# EAGLE design home_audio_dac_v0001 (EAGLE 6.4)

## Sheet 1 of 4
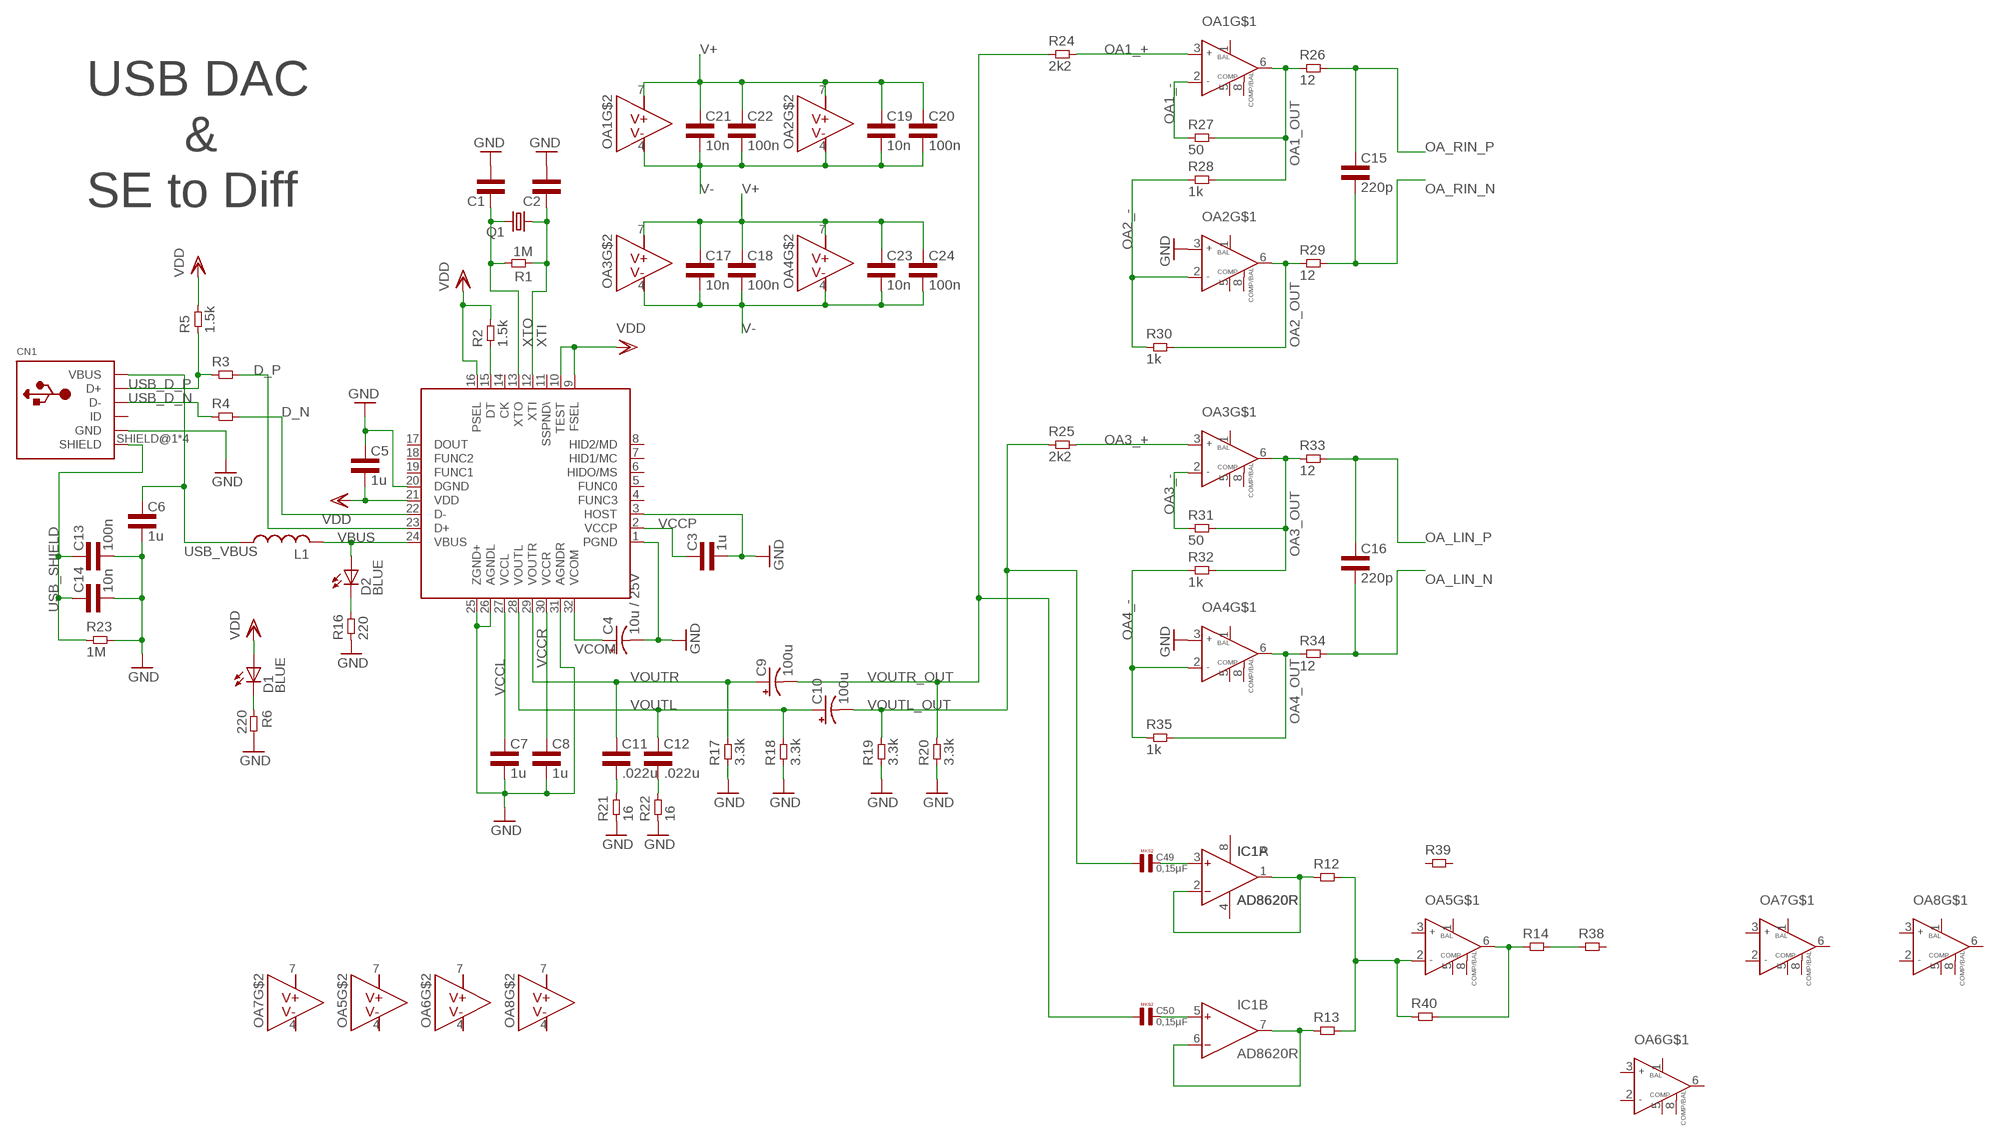
[diagram p0: schematic, sheet 1]

### Parts
C1  CAP0603L3  [0603L3]
C2  CAP0603L3  [0603L3]
C3  1u  CAP0603L3  [0603L3]
C4  10u / 25V  CPOL-USE1.8-4  [E1,8-4]
C5  1u  CAP0603L3  [0603L3]
C6  1u  CAP0603L3  [0603L3]
C7  1u  CAP0603L3  [0603L3]
C8  1u  CAP0603L3  [0603L3]
C9  100u  CPOL-USE2-5  [E2-5]
C10  100u  CPOL-USE2-5  [E2-5]
C11  .022u  CAP0603L3  [0603L3]
C12  .022u  CAP0603L3  [0603L3]
C13  100n  CAP0603L3  [0603L3]
C14  10n  CAP0603L3  [0603L3]
C15  220p  CAP0603L3  [0603L3]
C16  220p  CAP0603L3  [0603L3]
C17  10n  CAP0603L3  [0603L3]
C18  100n  CAP0603L3  [0603L3]
C19  10n  CAP0603L3  [0603L3]
C20  100n  CAP0603L3  [0603L3]
C21  10n  CAP0603L3  [0603L3]
C22  100n  CAP0603L3  [0603L3]
C23  10n  CAP0603L3  [0603L3]
C24  100n  CAP0603L3  [0603L3]
C49  0,15µF  [R5B2K5]
C50  0,15µF  [R5B2K5]
CN1  USBMINIB  [USB-MINIB]
D1  BLUE  LED-BLUE0603  [LED-0603]
D2  BLUE  LED-BLUE0603  [LED-0603]
IC1  AD8620R  [SO8]
L1  RCL_L-USL3225M  [RCL_L3225M]
OA1  NE5534ADSOIC8  [SOIC-8]
OA2  NE5534ADSOIC8  [SOIC-8]
OA3  NE5534ADSOIC8  [SOIC-8]
OA4  NE5534ADSOIC8  [SOIC-8]
OA5  NE5534SOIC8  [SOIC-8]
OA6  NE5534SOIC8  [SOIC-8]
OA7  NE5534SOIC8  [SOIC-8]
OA8  NE5534SOIC8  [SOIC-8]
Q1  PCM2707_V1_SPARKFUN_CRYSTALHC49US  [PCM2707_V1_SPARKFUN_HC49US]
R1  1M  RES0603L3  [0603L3]
R2  1.5k  RES0603L3  [0603L3]
R3  RES0603L3  [0603L3]
R4  RES0603L3  [0603L3]
R5  1.5k  RES0603L3  [0603L3]
R6  220  RES0603L3  [0603L3]
R12  RES0603L3  [0603L3]
R13  RES0603L3  [0603L3]
R14  RES0603L3  [0603L3]
R16  220  RES0603L3  [0603L3]
R17  3.3k  RES0603L3  [0603L3]
R18  3.3k  RES0603L3  [0603L3]
R19  3.3k  RES0603L3  [0603L3]
R20  3.3k  RES0603L3  [0603L3]
R21  16  RES0603L3  [0603L3]
R22  16  RES0603L3  [0603L3]
R23  1M  RES0603L3  [0603L3]
R24  2k2  RES0603L3  [0603L3]
R25  2k2  RES0603L3  [0603L3]
R26  12  RES0603L3  [0603L3]
R27  50  RES0603L3  [0603L3]
R28  1k  RES0603L3  [0603L3]
R29  12  RES0603L3  [0603L3]
R30  1k  RES0603L3  [0603L3]
R31  50  RES0603L3  [0603L3]
R32  1k  RES0603L3  [0603L3]
R33  12  RES0603L3  [0603L3]
R34  12  RES0603L3  [0603L3]
R35  1k  RES0603L3  [0603L3]
R38  RES0603L3  [0603L3]
R39  RES0603L3  [0603L3]
R40  RES0603L3  [0603L3]
U$1  PCM2707_V1_PCM2704C_PCM2707  [PCM2707_V1_PCM2704C_PCM2707]

### Nets
D_N: R4.P$2 U$1.22(D-)
D_P: R3.P$2 U$1.23(D+)
DT: R2.P$1 U$1.15(DT)
GND: C1.P$2 C2.P$2 C3.P$2 C4.- C5.P$1 C6.P$2 C7.P$2 C8.P$2 C13.P$2 C14.P$2 CN1.GND OA2.3(IN+) OA4.3(IN+) R6.P$2 R16.P$1 R17.P$1 R18.P$1 R19.P$1 R20.P$1 R21.P$1 R22.P$1 R23.P$2 U$1.1(PGND) U$1.3(HOST) U$1.20(DGND) U$1.25(ZGND+) U$1.26(AGNDL) U$1.31(AGNDR) ; also sheet 2,3,4
N$15: C49.2 IC1.3(A:IN+)
N$16: C50.2 IC1.5(B:IN+)
N$17: IC1.1(A:OUT) IC1.2(A:IN-) R12.P$1
N$18: IC1.6(B:IN-) IC1.7(B:OUT) R13.P$1
N$20: OA5.2(IN-) R12.P$2 R13.P$2 R40.P$1
N$22: OA5.6(OUT) R14.P$1 R40.P$2
N$23: R14.P$2 R38.P$1
N$56: D2.C R16.P$2
OA1_+: OA1.3(IN+) R24.P$2
OA1_-: OA1.2(IN-) R27.P$1
OA1_OUT: OA1.6(OUT) R26.P$1 R27.P$2 R28.P$2
OA2_-: OA2.2(IN-) R28.P$1 R30.P$1
OA2_OUT: OA2.6(OUT) R29.P$1 R30.P$2
OA3_+: OA3.3(IN+) R25.P$2
OA3_-: OA3.2(IN-) R31.P$1
OA3_OUT: OA3.6(OUT) R31.P$2 R32.P$2 R33.P$1
OA4_-: OA4.2(IN-) R32.P$1 R35.P$1
OA4_OUT: OA4.6(OUT) R34.P$1 R35.P$2
OA_LIN_N: C16.P$2 R34.P$2 ; also sheet 2
OA_LIN_P: C16.P$1 R33.P$2 ; also sheet 2
OA_RIN_N: C15.P$2 R29.P$2 ; also sheet 2
OA_RIN_P: C15.P$1 R26.P$2 ; also sheet 2
USB_D_N: CN1.D- R4.P$1
USB_D_P: CN1.D+ R3.P$1 R5.P$1
USB_SHIELD: C13.P$1 C14.P$1 CN1.SHIELD@1(SHIELD) CN1.SHIELD@2(SHIELD) CN1.SHIELD@3(SHIELD) CN1.SHIELD@4(SHIELD) R23.P$1
USB_VBUS: C6.P$1 CN1.VBUS L1.1
V+: C17.P$1 C18.P$1 C19.P$1 C20.P$1 C21.P$1 C22.P$1 C23.P$1 C24.P$1 OA1.7(V+) OA2.7(V+) OA3.7(V+) OA4.7(V+)
V-: C17.P$2 C18.P$2 C19.P$2 C20.P$2 C21.P$2 C22.P$2 C23.P$2 C24.P$2 OA1.4(V-) OA2.4(V-) OA3.4(V-) OA4.4(V-)
VBUS: D2.A L1.2 U$1.24(VBUS)
VCCL: C7.P$1 U$1.27(VCCL)
VCCP: C3.P$1 U$1.2(VCCP)
VCCR: C8.P$1 U$1.30(VCCR)
VCOM: C4.+ U$1.32(VCOM)
VDD: C5.P$2 D1.A R2.P$2 R5.P$2 U$1.9(FSEL) U$1.10(TEST) U$1.16(PSEL) U$1.21(VDD)
VDD_LED: D1.C R6.P$1
VOUTL: C10.+ C12.P$1 R18.P$2 U$1.28(VOUTL)
VOUTL_CAP: C12.P$2 R22.P$2
VOUTL_OUT: C10.- C49.1 R19.P$2 R25.P$1
VOUTR: C9.+ C11.P$1 R17.P$2 U$1.29(VOUTR)
VOUTR_CAP: C11.P$2 R21.P$2
VOUTR_OUT: C9.- C50.1 R20.P$2 R24.P$1
XTI: C2.P$1 Q1.1 R1.P$1 U$1.12(XTI)
XTO: C1.P$1 Q1.2 R1.P$2 U$1.13(XTO)
Unconnected: CN1.ID OA1.1(BAL) OA1.5(COMP) OA1.8(COMP/BAL) OA2.1(BAL) OA2.5(COMP) OA2.8(COMP/BAL) OA3.1(BAL) OA3.5(COMP) OA3.8(COMP/BAL) OA4.1(BAL) OA4.5(COMP) OA4.8(COMP/BAL) OA5.1(BAL) OA5.3(IN+) OA5.5(COMP) OA5.8(COMP/BAL) OA6.1(BAL) OA6.2(IN-) OA6.3(IN+) OA6.5(COMP) OA6.6(OUT) OA6.8(COMP/BAL) OA7.1(BAL) OA7.2(IN-) OA7.3(IN+) OA7.5(COMP) OA7.6(OUT) OA7.8(COMP/BAL) OA8.1(BAL) OA8.2(IN-) OA8.3(IN+) OA8.5(COMP) OA8.6(OUT) OA8.8(COMP/BAL) R38.P$2 R39.P$1 R39.P$2 U$1.4(FUNC3) U$1.5(FUNC0) U$1.6(HIDO/MS) U$1.7(HID1/MC) U$1.8(HID2/MD) U$1.11(SSPND\) U$1.14(CK) U$1.17(DOUT) U$1.18(FUNC2) U$1.19(FUNC1)

### Notes on the sheet
- USB DAC
- &
- SE to Diff

## Sheet 2 of 4
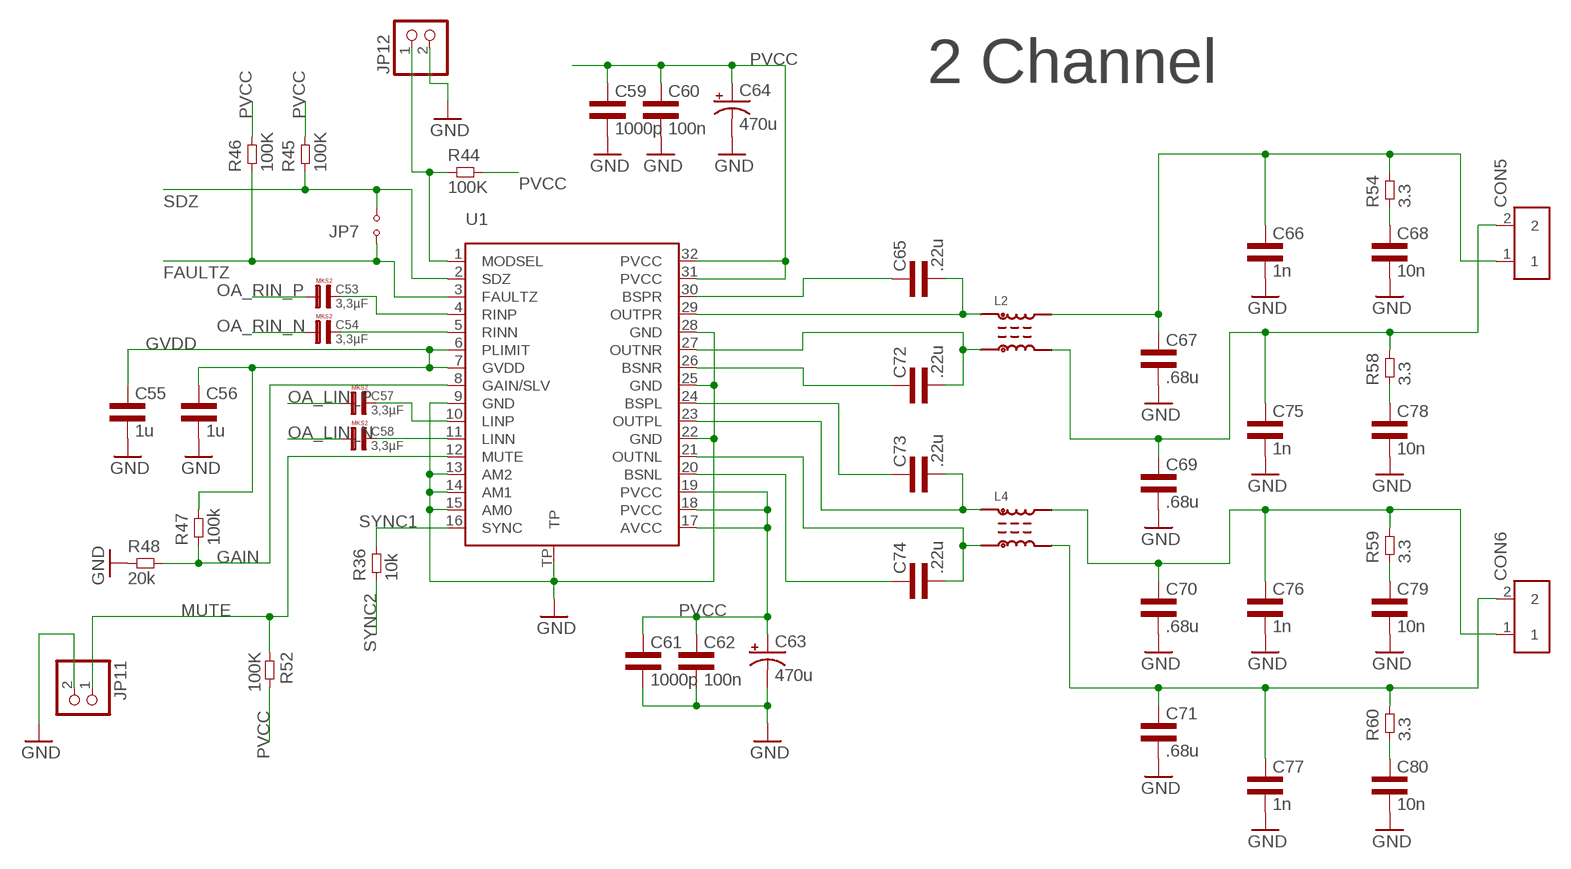
[diagram p1: schematic, sheet 2]

### Parts
C53  3,3µF  [R5B5K5]
C54  3,3µF  [R5B5K5]
C55  1u  CAP0603L3  [0603L3]
C56  1u  CAP0603L3  [0603L3]
C57  3,3µF  [R5B5K5]
C58  3,3µF  [R5B5K5]
C59  1000p  CAP0805L3  [0805L3]
C60  100n  CAP0805L3  [0805L3]
C61  1000p  CAP0805L3  [0805L3]
C62  100n  CAP0805L3  [0805L3]
C63  470u  CPOL-USF  [PANASONIC_F]
C64  470u  CPOL-USF  [PANASONIC_F]
C65  .22u  CAP0805L3  [0805L3]
C66  1n  CAP0603L3  [0603L3]
C67  .68u  CAP1206L3  [1206L3]
C68  10n  CAP0805L3  [0805L3]
C69  .68u  CAP1206L3  [1206L3]
C70  .68u  CAP1206L3  [1206L3]
C71  .68u  CAP1206L3  [1206L3]
C72  .22u  CAP0805L3  [0805L3]
C73  .22u  CAP0805L3  [0805L3]
C74  .22u  CAP0805L3  [0805L3]
C75  1n  CAP0603L3  [0603L3]
C76  1n  CAP0603L3  [0603L3]
C77  1n  CAP0603L3  [0603L3]
C78  10n  CAP0805L3  [0805L3]
C79  10n  CAP0805L3  [0805L3]
C80  10n  CAP0805L3  [0805L3]
CON5  TERM_BLOCK_2  [TERM_BLOCK_2]
CON6  TERM_BLOCK_2  [TERM_BLOCK_2]
JP7  JUMPER2  [JUMPER2]
JP11  PINHD-1X2  [1X02]
JP12  PINHD-1X2  [1X02]
L2  1155EA  [1155EA]
L4  1155EA  [1155EA]
R36  10k  RES0603L3  [0603L3]
R44  100K  RES0603L3  [0603L3]
R45  100K  RES0603L3  [0603L3]
R46  100K  RES0603L3  [0603L3]
R47  100k  RES0603L3  [0603L3]
R48  20k  RES0603L3  [0603L3]
R52  100K  RES0603L3  [0603L3]
R54  3.3  RES0805L3  [0805L3]
R58  3.3  RES0805L3  [0805L3]
R59  3.3  RES0805L3  [0805L3]
R60  3.3  RES0805L3  [0805L3]
U1  TPA3116  [R-PDSO-32]

### Nets
FAULTZ: JP7.1 R46.P$1 U1.3(FAULTZ) ; also sheet 3
GAIN: R47.P$1 R48.P$2 U1.8(GAIN/SLV) ; also sheet 3
GND: C55.P$2 C56.P$2 C59.2 C60.2 C61.2 C62.2 C63.- C64.- C66.P$2 C67.2 C68.2 C69.2 C70.2 C71.2 C75.P$2 C76.P$2 C77.P$2 C78.2 C79.2 C80.2 JP11.2 JP12.2 R48.P$1 U1.9(GND) U1.13(AM2) U1.14(AM1) U1.15(AM0) U1.22(GND) U1.25(GND) U1.28(GND) U1.TP ; also sheet 1,3,4
GVDD: C55.P$1 C56.P$1 R47.P$2 U1.6(PLIMIT) U1.7(GVDD) ; also sheet 3
LIN_CAP1_N: C58.2 U1.11(LINN)
LIN_CAP1_P: C57.2 U1.10(LINP)
MODSEL1: JP12.1 R44.P$1 U1.1(MODSEL)
MUTE: JP11.1 R52.P$1 U1.12(MUTE) ; also sheet 3
N$5: C65.1 U1.30(BSPR)
N$6: C65.2 L2.4 U1.29(OUTPR)
N$21: C66.P$1 C67.1 CON5.1 L2.3 R54.2
N$25: C68.1 R54.1
N$26: C72.1 U1.26(BSNR)
N$27: C73.1 U1.24(BSPL)
N$28: C74.1 U1.20(BSNL)
N$29: C72.2 L2.1 U1.27(OUTNR)
N$31: C73.2 L4.4 U1.23(OUTPL)
N$34: C74.2 L4.1 U1.21(OUTNL)
N$35: C69.1 C75.P$1 CON5.2 L2.2 R58.2
N$36: C70.1 C76.P$1 CON6.1 L4.3 R59.2
N$37: C71.1 C77.P$1 CON6.2 L4.2 R60.2
N$38: C78.1 R58.1
N$39: C79.1 R59.1
N$40: C80.1 R60.1
OA_LIN_N: C58.1 ; also sheet 1
OA_LIN_P: C57.1 ; also sheet 1
OA_RIN_N: C54.1 ; also sheet 1
OA_RIN_P: C53.1 ; also sheet 1
PVCC: C59.1 C60.1 C61.1 C62.1 C63.+ C64.+ R44.P$2 R45.P$2 R46.P$2 R52.P$2 U1.17(AVCC) U1.18(PVCC) U1.19(PVCC) U1.31(PVCC) U1.32(PVCC) ; also sheet 3
RIN_CAP1_N: C54.2 U1.5(RINN)
RIN_CAP1_P: C53.2 U1.4(RINP)
SDZ: JP7.2 R45.P$1 U1.2(SDZ) ; also sheet 3
SYNC1: R36.P$2 U1.16(SYNC)
SYNC2: R36.P$1 ; also sheet 3

### Notes on the sheet
- 2 Channel

## Sheet 3 of 4
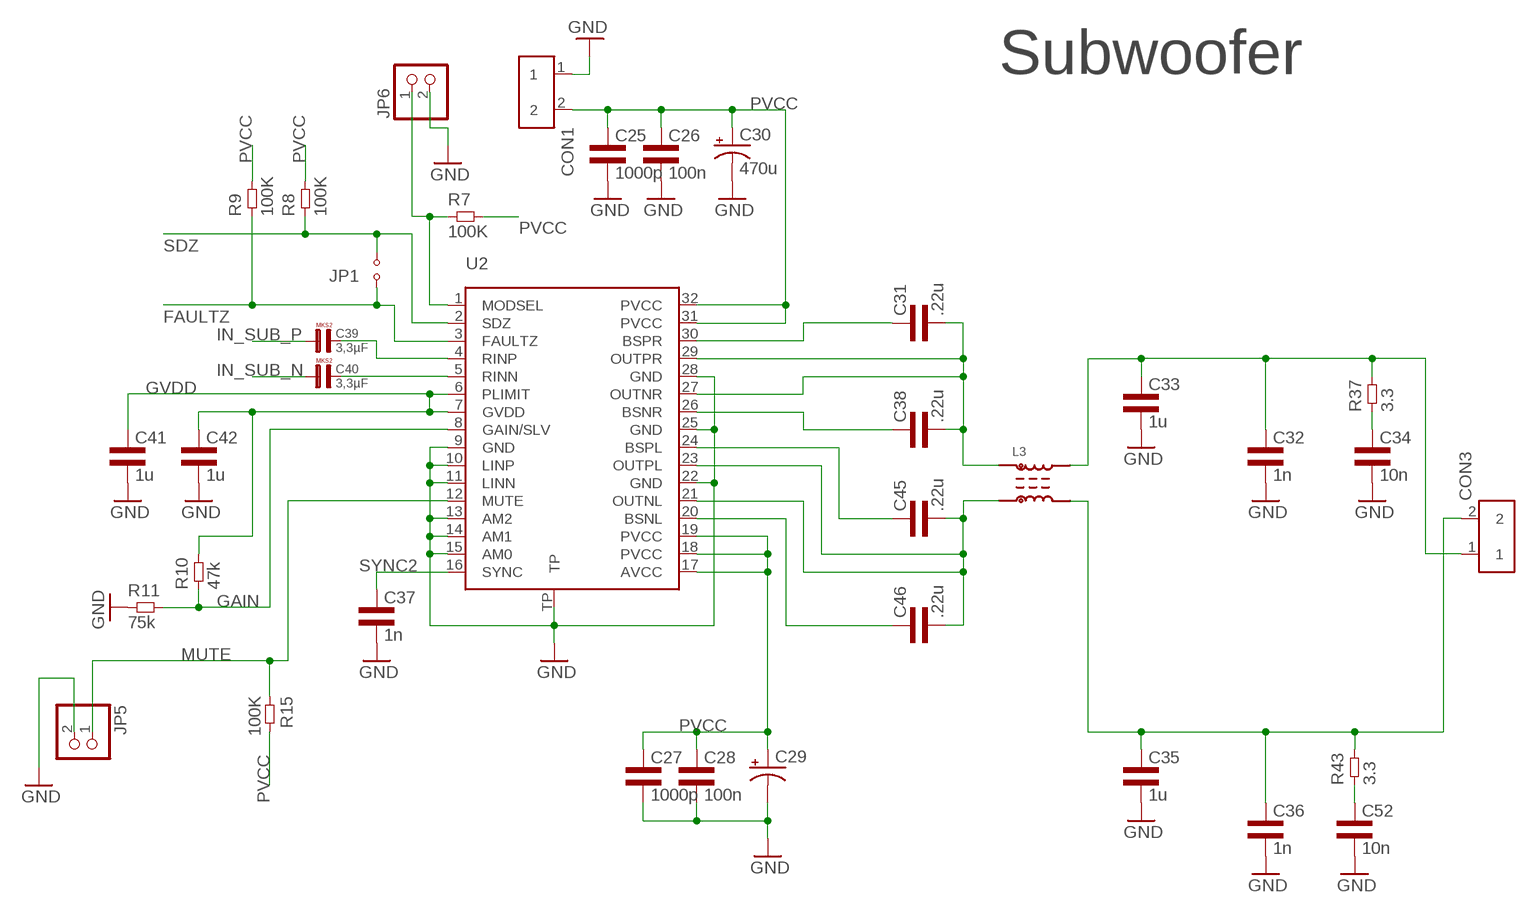
[diagram p2: schematic, sheet 3]

### Parts
C25  1000p  CAP0805L3  [0805L3]
C26  100n  CAP0805L3  [0805L3]
C27  1000p  CAP0805L3  [0805L3]
C28  100n  CAP0805L3  [0805L3]
C29  CPOL-USF  [PANASONIC_F]
C30  470u  CPOL-USF  [PANASONIC_F]
C31  .22u  CAP0805L3  [0805L3]
C32  1n  CAP0603L3  [0603L3]
C33  1u  CAP1206L3  [1206L3]
C34  10n  CAP0805L3  [0805L3]
C35  1u  CAP1206L3  [1206L3]
C36  1n  CAP0603L3  [0603L3]
C37  1n  CAP0603L3  [0603L3]
C38  .22u  CAP0805L3  [0805L3]
C39  3,3µF  [R5B5K5]
C40  3,3µF  [R5B5K5]
C41  1u  CAP0603L3  [0603L3]
C42  1u  CAP0603L3  [0603L3]
C45  .22u  CAP0805L3  [0805L3]
C46  .22u  CAP0805L3  [0805L3]
C52  10n  CAP0805L3  [0805L3]
CON1  TERM_BLOCK_2  [TERM_BLOCK_2]
CON3  TERM_BLOCK_2  [TERM_BLOCK_2]
JP1  JUMPER2  [JUMPER2]
JP5  PINHD-1X2  [1X02]
JP6  PINHD-1X2  [1X02]
L3  1155EA  [1155EA]
R7  100K  RES0603L3  [0603L3]
R8  100K  RES0603L3  [0603L3]
R9  100K  RES0603L3  [0603L3]
R10  47k  RES0603L3  [0603L3]
R11  75k  RES0603L3  [0603L3]
R15  100K  RES0603L3  [0603L3]
R37  3.3  RES0805L3  [0805L3]
R43  3.3  RES0805L3  [0805L3]
U2  TPA3116  [R-PDSO-32]

### Nets
FAULTZ: JP1.1 R9.P$1 U2.3(FAULTZ) ; also sheet 2
GAIN: R10.P$1 R11.P$2 U2.8(GAIN/SLV) ; also sheet 2
GND: C25.2 C26.2 C27.2 C28.2 C29.- C30.- C32.P$2 C33.2 C34.2 C35.2 C36.P$2 C37.P$2 C41.P$2 C42.P$2 C52.2 CON1.1 JP5.2 JP6.2 R11.P$1 U2.9(GND) U2.10(LINP) U2.11(LINN) U2.13(AM2) U2.14(AM1) U2.15(AM0) U2.22(GND) U2.25(GND) U2.28(GND) U2.TP ; also sheet 1,2,4
GVDD: C41.P$1 C42.P$1 R10.P$2 U2.6(PLIMIT) U2.7(GVDD) ; also sheet 2
IN_SUB_CAP_N: C40.2 U2.5(RINN)
IN_SUB_CAP_P: C39.2 U2.4(RINP)
IN_SUB_N: C40.1
IN_SUB_P: C39.1
MODSEL: JP6.1 R7.P$1 U2.1(MODSEL)
MUTE: JP5.1 R15.P$1 U2.12(MUTE) ; also sheet 2
N$1: C31.1 U2.30(BSPR)
N$2: C31.2 C38.2 L3.4 U2.27(OUTNR) U2.29(OUTPR)
N$4: C32.P$1 C33.1 CON3.1 L3.3 R37.2
N$7: C34.1 R37.1
N$8: C38.1 U2.26(BSNR)
N$9: C45.1 U2.24(BSPL)
N$10: C46.1 U2.20(BSNL)
N$13: C45.2 C46.2 L3.1 U2.21(OUTNL) U2.23(OUTPL)
N$19: C35.1 C36.P$1 CON3.2 L3.2 R43.2
N$24: C52.1 R43.1
PVCC: C25.1 C26.1 C27.1 C28.1 C29.+ C30.+ CON1.2 R7.P$2 R8.P$2 R9.P$2 R15.P$2 U2.17(AVCC) U2.18(PVCC) U2.19(PVCC) U2.31(PVCC) U2.32(PVCC) ; also sheet 2
SDZ: JP1.2 R8.P$1 U2.2(SDZ) ; also sheet 2
SYNC2: C37.P$1 U2.16(SYNC) ; also sheet 2

### Notes on the sheet
- Subwoofer

## Sheet 4 of 4
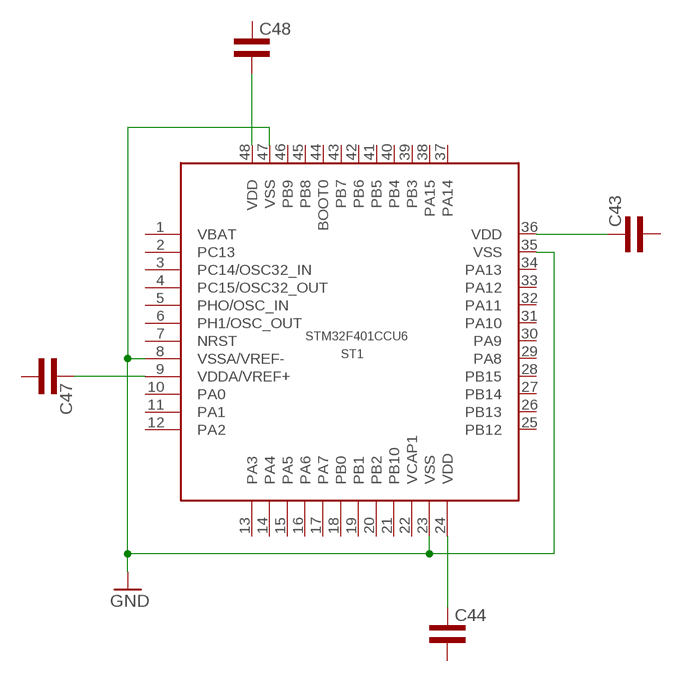
[diagram p3: schematic, sheet 4]

### Parts
C43  CAP0603L3  [0603L3]
C44  CAP0603L3  [0603L3]
C47  CAP0603L3  [0603L3]
C48  CAP0603L3  [0603L3]
ST1  STM32F401CCU6  [UFQFPN48]

### Nets
GND: ST1.8(VSSA/VREF-) ST1.23(VSS) ST1.35(VSS) ST1.47(VSS) ; also sheet 1,2,3
N$3: C48.P$2 ST1.48(VDD)
N$11: C47.P$1 ST1.9(VDDA/VREF+)
N$12: C44.P$1 ST1.24(VDD)
N$14: C43.P$1 ST1.36(VDD)
Unconnected: C43.P$2 C44.P$2 C47.P$2 C48.P$1 ST1.1(VBAT) ST1.2(PC13) ST1.3(PC14/OSC32_IN) ST1.4(PC15/OSC32_OUT) ST1.5(PHO/OSC_IN) ST1.6(PH1/OSC_OUT) ST1.7(NRST) ST1.10(PA0) ST1.11(PA1) ST1.12(PA2) ST1.13(PA3) ST1.14(PA4) ST1.15(PA5) ST1.16(PA6) ST1.17(PA7) ST1.18(PB0) ST1.19(PB1) ST1.20(PB2) ST1.21(PB10) ST1.22(VCAP1) ST1.25(PB12) ST1.26(PB13) ST1.27(PB14) ST1.28(PB15) ST1.29(PA8) ST1.30(PA9) ST1.31(PA10) ST1.32(PA11) ST1.33(PA12) ST1.34(PA13) ST1.37(PA14) ST1.38(PA15) ST1.39(PB3) ST1.40(PB4) ST1.41(PB5) ST1.42(PB6) ST1.43(PB7) ST1.44(BOOT0) ST1.45(PB8) ST1.46(PB9)

## Power pins joined to a net without a drawn wire
V+: IC1.8(P:V+) OA5.7(V+) OA6.7(V+) OA7.7(V+) OA8.7(V+)
V-: IC1.4(P:V-) OA5.4(V-) OA6.4(V-) OA7.4(V-) OA8.4(V-)

## Library data of the parts
C1-C3 C5-C8 C11-C28 C31-C38 C41-C48 C52 C55 C56 C59-C62 C65-C80 = common:CAP
C4 C9 C10 C29 C30 C63 C64 = rcl:CPOL-US: POLARIZED CAPACITOR, American symbol
C39 C40 C53 C54 C57 C58 = Capacitor-Wima-MKS2-16v:3,3µF
C49 C50 = Capacitor-Wima-MKS2-63v:0,15µF
CN1 = adafruit:USB: USB Connectors USBMINIB - Surface Mount Female Mini-B USB Connector 4UConnector: 06564 By microbuilder.eu Thru-hole RA Female Mini-B USB Connector 4UConnector: 18732 By ladyada.net
CON1 CON3 CON5 CON6 = common:TERM_BLOCK_2
D1 D2 = SparkFun-LED:LED-BLUE: Blue LEDs for production use Various blue LEDs stocked by SparkFun production 0603 - DIO-08575 Rebel - DIO-09553 1206 - DIO-09911; PROD_ID: DIO-08575
IC1 = analog-devices:AD8620: Precision, Very Low Noise, Low Input Bias Current, Wide Bandwidth JFET Operational Amplifiers Source: http://www.analog.com/static/imported-files/data_sheets/AD8610_8620.pdf; MF: ALTERA CORPORATION; MPN: AD8620ARZ; OC_FARNELL: 9994386; OC_NEWARK: 59K6972
JP1 JP7 = common:JUMPER2
JP5 JP6 JP11 JP12 = pinhead:PINHD-1X2: PIN HEADER
L1 = pcm2707_v1:RCL_L-US: INDUCTOR, American symbol
L2-L4 = common:1155EA: Automotive dual-inductor for audio applications. Was made by Toko, now made by Murata. Old part # is HEAW.
OA1-OA4 = common:NE5534: Low-noise, high-SP audio Op Amp.; BIAS_CURRENT: 500nA; CMRR: 100dB; GAIN_BANDWIDTH_PRODUCT: 10MHz; IN-VOL_NOISE_DENSITY: 3.5nV; OFFSET_VOL: 500uV; OUTPUT_CURRENT: 38mA; SLEW_RATE: 13V/uS; SUPPLY_CURRENT: 4mA; SUPPLY_VOL_MAX: 30V; SUPPLY_VOL_MIN: 10V
OA5-OA8 = common:NE5534: Low-noise, high-SP audio Op Amp.
Q1 = my_dac_amp:PCM2707_V1_SPARKFUN_CRYSTAL: Crystals Various standard crystals. Proven footprints. Spark Fun Electronics SKU : COM-00534
R1-R40 R43-R48 R52 R54 R58-R60 = common:RES
ST1 = common:STM32F401CCU6
U1 U2 = common:TPA3116: TPA3116D2 15-W, 30-W, 50-W Filter-Free Class-D Stereo Amplifier Family With AM Avoidance
U$1 = my_dac_amp:PCM2707_V1_PCM2704C_PCM2707: Upgraded version of the PCM2704. It allows connecting to a device with USB and transmitting that data to another DAC using I2S protocol. Also has other advanced features that allow control with SPI, external buttons, etc.

## Board
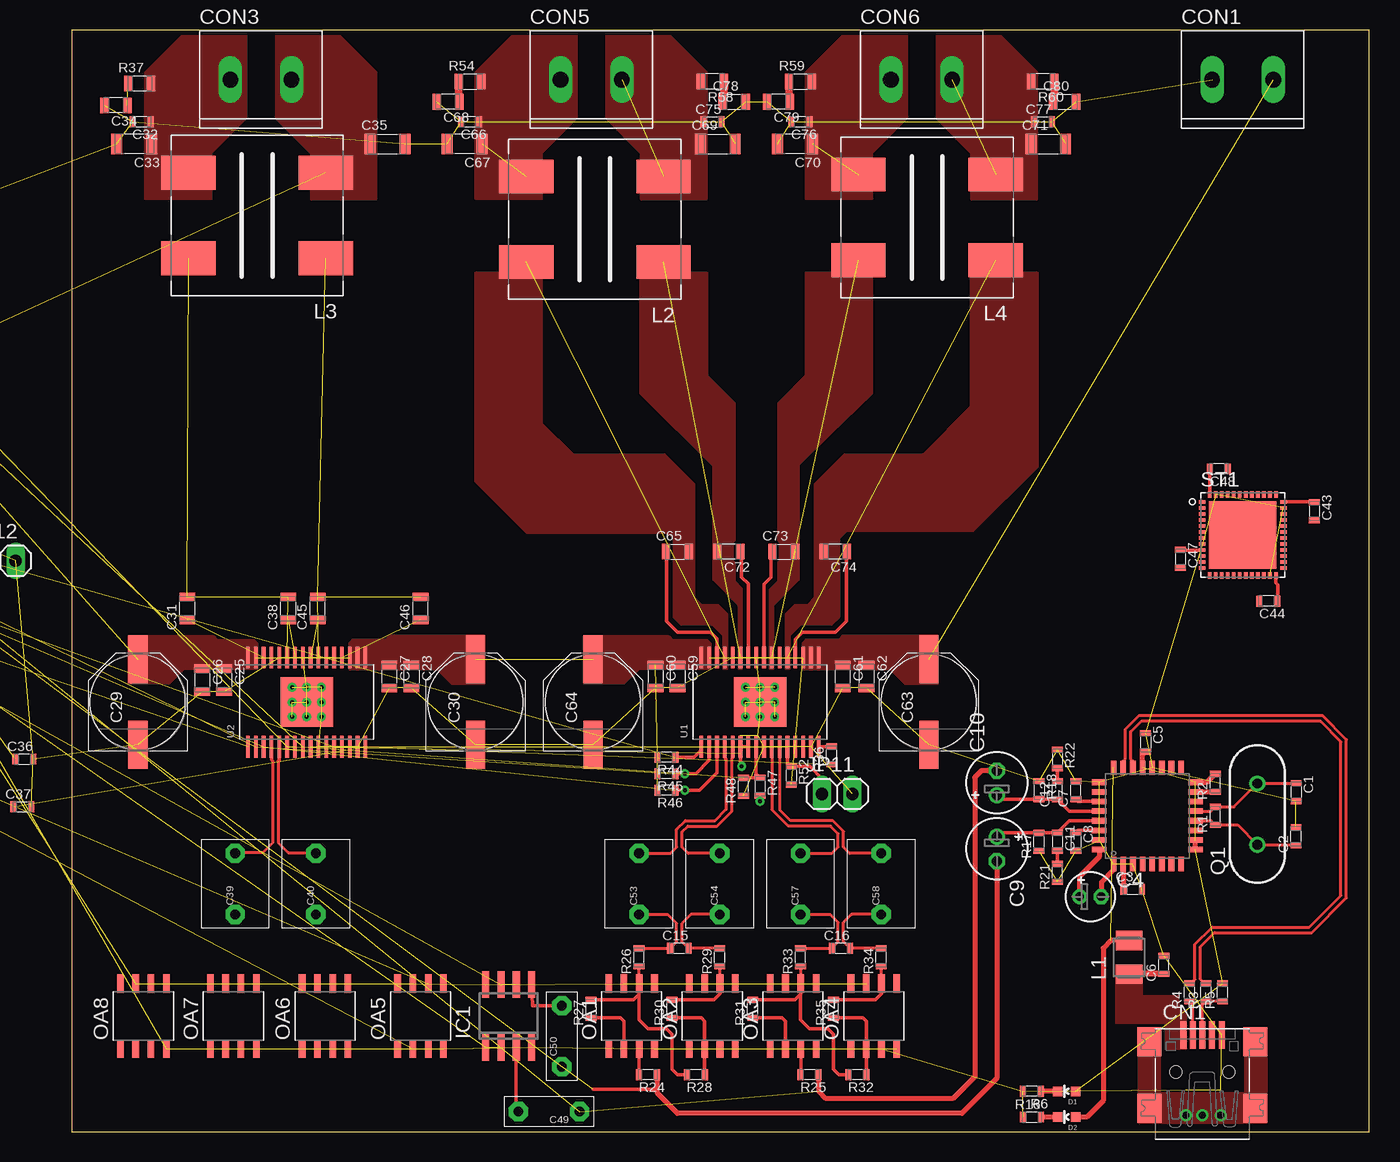
[diagram p4: board, top side]
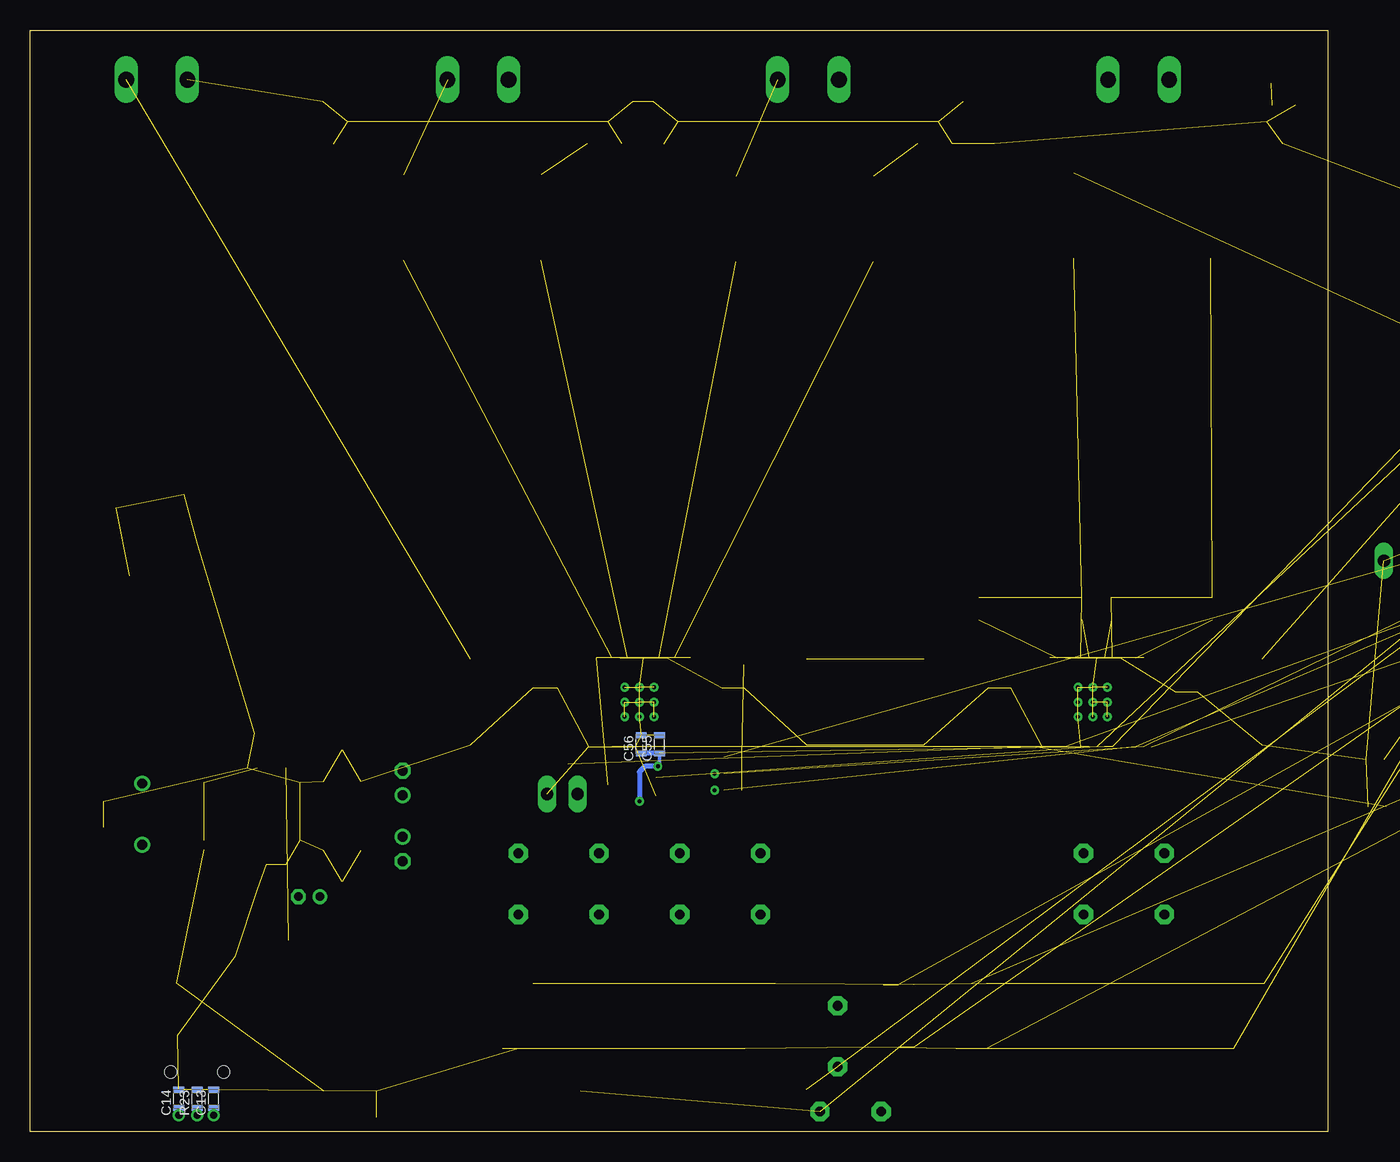
[diagram p5: board, bottom side, seen from below]

Size 107.75 x 91.44 mm. Coordinates in mm from the lower left corner, seen from the top.
Outline: 0,0 107.75,0 107.75,91.44 0,91.44 0,0
Copper layers (1*16): Top 0.035mm / dielectric 1.5mm / Bottom 0.035mm
Design rules "default *": minimum track width 10mil, minimum drill 24mil, track to track 8mil, track to pad 8mil, pad to pad 8mil, via to via 8mil, smd to smd 8mil, copper to edge 16mil, drill to drill 8mil, minimum pad ring 10mil, minimum via ring 8mil, stop-mask expansion 4mil, vias tented up to drill 0mil, thermal gap 10mil

### Footprints (pad centres in the part's own frame; a part is rotated, then mirrored left to right if it is on the bottom)
0603L3 = smd 0.5 x 0.9: P$1 -0.75,0; P$2 0.75,0
E1,8-4 = drill 0.711 pad 1.168: + -0.889,0 | drill 0.711 pad 1.168 octagon: - 0.889,0
E2-5 = drill 0.813 pad 1.27: + -1.016,0 | drill 0.813 pad 1.27 octagon: - 1.016,0
0805L3 = smd 0.7 x 1.3: 1 -0.95,0; 2 0.95,0
PANASONIC_F = smd 4 x 1.6: + 3.55,0; - -3.55,0
1206L3 = smd 0.9 x 1.7: 1 -1.45,0; 2 1.45,0
R5B5K5 = drill 0.813 pad 1.6 octagon: 1 -2.54,0; 2 2.54,0
R5B2K5 = drill 0.813 pad 1.6 octagon: 1 -2.54,0; 2 2.54,0
USB-MINIB = smd 0.5 x 2.308: D+ 0,4.064; D- -0.8,4.064; GND 1.6,4.064; ID 0.8,4.064; VBUS -1.6,4.064 | smd 2 x 2.4: SHIELD@1 -4.4,3.5; SHIELD@2 -4.4,-2; SHIELD@3 4.4,-2; SHIELD@4 4.4,3.5 | hole 1: -2.2,1; 2.2,1
TERM_BLOCK_2 = drill 1.3 long: 1 -2.54,0; 2 2.54,0
LED-0603 = smd 0.8 x 0.8: A 0,-0.75; C 0,0.75
SO8 = smd 0.6 x 2.2: 1 -1.905,-2.6; 2 -0.635,-2.6; 3 0.635,-2.6; 4 1.905,-2.6; 5 1.905,2.6; 6 0.635,2.6; 7 -0.635,2.6; 8 -1.905,2.6
JUMPER2 = drill 1.016 long: 1 -1.27,0; 2 1.27,0
1X02 = drill 1.016 long: 1 -1.27,0; 2 1.27,0
RCL_L3225M = smd 1.6 x 2.2: 1 -1.4,0; 2 1.4,0
1155EA = smd 4.5 x 2.8: 1 -5.7,3.55; 2 -5.7,-3.55; 3 5.7,-3.55; 4 5.7,3.55
SOIC-8 = smd 0.55 x 1.5: 1 -1.905,-2.7; 2 -0.635,-2.7; 3 0.635,-2.7; 4 1.905,-2.7; 5 1.905,2.7; 6 0.635,2.7; 7 -0.635,2.7; 8 -1.905,2.7
PCM2707_V1_SPARKFUN_HC49US = drill 0.813: 1 -2.54,0; 2 2.54,0
UFQFPN48 = smd 0.55 x 0.3: 1 -3.375,2.75; 2 -3.375,2.25; 3 -3.375,1.75; 4 -3.375,1.25; 5 -3.375,0.75; 6 -3.375,0.25; 7 -3.375,-0.25; 8 -3.375,-0.75; 9 -3.375,-1.25; 10 -3.375,-1.75; 11 -3.375,-2.25; 12 -3.375,-2.75; 25 3.375,-2.75; 26 3.375,-2.25; 27 3.375,-1.75; 28 3.375,-1.25; 29 3.375,-0.75; 30 3.375,-0.25; 31 3.375,0.25; 32 3.375,0.75; 33 3.375,1.25; 34 3.375,1.75; 35 3.375,2.25; 36 3.375,2.75 | smd 0.3 x 0.55: 13 -2.75,-3.375; 14 -2.25,-3.375; 15 -1.75,-3.375; 16 -1.25,-3.375; 17 -0.75,-3.375; 18 -0.25,-3.375; 19 0.25,-3.375; 20 0.75,-3.375; 21 1.25,-3.375; 22 1.75,-3.375; 23 2.25,-3.375; 24 2.75,-3.375; 37 2.75,3.375; 38 2.25,3.375; 39 1.75,3.375; 40 1.25,3.375; 41 0.75,3.375; 42 0.25,3.375; 43 -0.25,3.375; 44 -0.75,3.375; 45 -1.25,3.375; 46 -1.75,3.375; 47 -2.25,3.375; 48 -2.75,3.375 | smd 5.6 x 5.6: TP 0,0
R-PDSO-32 = smd 0.3 x 1.8: 1 -4.875,-3.7; 2 -4.225,-3.7; 3 -3.575,-3.7; 4 -2.925,-3.7; 5 -2.275,-3.7; 6 -1.625,-3.7; 7 -0.975,-3.7; 8 -0.325,-3.7; 9 0.325,-3.7; 10 0.975,-3.7; 11 1.625,-3.7; 12 2.275,-3.7; 13 2.925,-3.7; 14 3.575,-3.7; 15 4.225,-3.7; 16 4.875,-3.7; 17 4.875,3.7; 18 4.225,3.7; 19 3.575,3.7; 20 2.925,3.7; 21 2.275,3.7; 22 1.625,3.7; 23 0.975,3.7; 24 0.325,3.7; 25 -0.325,3.7; 26 -0.975,3.7; 27 -1.625,3.7; 28 -2.275,3.7; 29 -2.925,3.7; 30 -3.575,3.7; 31 -4.225,3.7; 32 -4.875,3.7 | smd 4.36 x 4.11: TP 0,0
PCM2707_V1_PCM2704C_PCM2707 = smd 0.47 x 1.2: 1 -2.8,-4; 2 -2,-4; 3 -1.2,-4; 4 -0.4,-4; 5 0.4,-4; 6 1.2,-4; 7 2,-4; 8 2.8,-4; 17 2.8,4; 18 2,4; 19 1.2,4; 20 0.4,4; 21 -0.4,4; 22 -1.2,4; 23 -2,4; 24 -2.8,4 | smd 1.2 x 0.47: 9 4,-2.8; 10 4,-2; 11 4,-1.2; 12 4,-0.4; 13 4,0.4; 14 4,1.2; 15 4,2; 16 4,2.8; 25 -4,2.8; 26 -4,2; 27 -4,1.2; 28 -4,0.4; 29 -4,-0.4; 30 -4,-1.2; 31 -4,-2; 32 -4,-2.8

### Placement (x,y rotation side)
C1  101.65,28.19 270 top
C2  101.65,24.54 90 top
C3  88.09,20.12 0 top
C4  84.58,19.51 0 top
C5  89.15,32.31 270 top
C6  90.68,13.87 90 top
C7  83.36,28.35 90 top
C8  83.36,24.08 270 top
C9  76.81,23.47 270 top
C10  76.81,28.96 90 top
C11  81.84,24.08 270 top
C12  81.84,28.35 90 top
C13  92.51,2.74 90 bottom
C14  95.4,2.74 90 bottom
C15  50.44,15.24 0 top
C16  63.86,15.24 0 top
C17  not placed on the board
C18  not placed on the board
C19  not placed on the board
C20  not placed on the board
C21  not placed on the board
C22  not placed on the board
C23  not placed on the board
C24  not placed on the board
C25  12.65,37.49 270 top
C26  10.82,37.49 270 top
C27  26.37,37.8 270 top
C28  28.19,37.8 270 top
C29  5.49,35.66 90 top
C30  33.53,35.66 90 top
C31  9.6,43.43 90 top
C32  5.79,83.82 180 top
C33  5.18,81.99 180 top
C34  3.66,85.19 180 top
C35  26.21,81.99 0 top
C36  not placed on the board
C37  not placed on the board
C38  17.98,43.43 90 top
C39  13.56,20.57 90 top
C40  20.27,20.57 90 top
C41  not placed on the board
C42  not placed on the board
C43  103.17,51.51 270 top
C44  99.36,44.04 180 top
C45  20.42,43.43 90 top
C46  28.96,43.43 90 top
C47  92.05,47.55 270 top
C48  95.25,55.02 180 top
C49  39.62,1.68 180 top
C50  40.69,7.92 90 top
C52  not placed on the board
C53  47.09,20.57 90 top
C54  53.8,20.57 90 top
C55  55.47,32.16 90 bottom
C56  57,32.16 90 bottom
C57  60.5,20.57 90 top
C58  67.21,20.57 90 top
C59  50.29,37.8 270 top
C60  48.46,37.8 270 top
C61  64.01,37.8 270 top
C62  65.99,37.8 270 top
C63  71.17,35.66 90 top
C64  43.28,35.66 90 top
C65  50.29,48.16 0 top
C66  33.07,83.82 180 top
C67  32.61,81.99 180 top
C68  31.24,85.5 180 top
C69  53.64,81.99 0 top
C70  60.05,81.99 180 top
C71  81.08,81.99 0 top
C72  54.56,48.16 180 top
C73  59.13,48.16 0 top
C74  63.4,48.16 180 top
C75  53.19,83.82 0 top
C76  60.5,83.82 180 top
C77  80.62,83.82 0 top
C78  55.02,85.5 0 top
C79  58.67,85.5 180 top
C80  82.45,85.5 0 top
CN1  93.88,3.96 0 top
CON1  97.23,87.33 0 top
CON3  15.7,87.33 0 top
CON5  43.13,87.33 0 top
CON6  70.56,87.33 0 top
D1  82.6,3.35 90 top
D2  82.6,1.22 90 top
IC1  36.27,9.6 0 top
JP1  not placed on the board
JP5  not placed on the board
JP6  not placed on the board
JP7  not placed on the board
JP11  63.55,28.04 0 top
JP12  not placed on the board
L1  87.78,14.48 90 top
L2  43.43,75.74 180 top
L3  15.39,76.05 180 top
L4  71.02,75.9 180 top
OA1  46.48,9.6 0 top
OA2  53.19,9.6 0 top
OA3  59.89,9.6 0 top
OA4  66.6,9.6 0 top
OA5  28.96,9.6 0 top
OA6  21.03,9.6 0 top
OA7  13.41,9.6 0 top
OA8  5.94,9.6 0 top
Q1  98.45,26.37 90 top
R1  94.95,26.21 90 top
R2  94.95,28.96 90 top
R3  94.18,11.58 90 top
R4  92.81,11.58 90 top
R5  95.55,11.58 90 top
R6  79.71,3.35 180 top
R7  not placed on the board
R8  not placed on the board
R9  not placed on the board
R10  not placed on the board
R11  not placed on the board
R12  not placed on the board
R13  not placed on the board
R14  not placed on the board
R15  not placed on the board
R16  79.71,1.22 0 top
R17  80.31,24.08 90 top
R18  80.31,28.35 270 top
R19  not placed on the board
R20  not placed on the board
R21  81.84,21.49 90 top
R22  81.84,30.94 270 top
R23  93.88,2.74 90 bottom
R24  47.85,4.72 180 top
R25  61.26,4.72 180 top
R26  47.09,14.48 90 top
R27  43.13,10.21 90 top
R28  51.82,4.72 180 top
R29  53.8,14.48 90 top
R30  49.83,10.21 90 top
R31  56.54,10.21 90 top
R32  65.23,4.72 180 top
R33  60.5,14.48 90 top
R34  67.21,14.48 90 top
R35  63.25,10.21 90 top
R36  63.09,31.24 90 top
R37  5.64,87.02 0 top
R38  not placed on the board
R39  not placed on the board
R40  not placed on the board
R43  not placed on the board
R44  49.38,31.09 180 top
R45  49.38,29.72 180 top
R46  49.38,28.35 180 top
R47  57.15,28.65 270 top
R48  55.78,28.65 90 top
R52  59.74,29.57 270 top
R54  33.07,87.17 0 top
R58  53.19,87.17 180 top
R59  60.5,87.17 0 top
R60  80.62,87.17 180 top
ST1  97.23,49.53 0 top
U1  57.15,35.66 0 top
U2  19.51,35.66 0 top
U$1  89.31,26.21 0 top

### Tracks (layer width: path | path; a pad name or v marks a point on that pad's centre or on a via)
D_N
  Top 0.254: R4.P$2 92.95,12.33 93.27,12.65 93.27,15.56 94.7,16.99 102.78,16.99 105.39,19.6 105.39,32.37 103.69,34.06 88.79,34.06 87.94,33.2 87.94,30.94 88.11,30.77 U$1.22
D_P
  Top 0.254: R3.P$2 94.04,12.33 93.73,12.65 93.73,15.37 94.89,16.54 102.97,16.54 105.84,19.41 105.84,32.56 103.88,34.52 88.6,34.52 87.48,33.39 87.48,30.94 87.31,30.77 U$1.23
DT
  Top 0.406: U$1.15 94.94,28.21 R2.P$1
FAULTZ  (via drill 0.33)  (4 unrouted)
  Top 0.305: U1.3 53.58,29.8 52.12,28.35 v50.9,28.35 R46.P$1
GAIN  (3 unrouted)
  Top 0.305: U1.8 56.83,29.73 R47.P$1 R48.P$2
GND  (via drill 0.33)  (106 unrouted)
  Top 0.406: U$1.1 86.51,21.74 85.5,20.73 85.5,19.53 C4.-
  other vias: 57.15,35.66 55.93,36.88 57.15,36.88 58.37,36.88 55.93,35.66 58.37,35.66 55.93,34.44 57.15,34.44 58.37,34.44 19.51,35.66 18.29,36.88 18.29,35.66 18.29,34.44 19.51,34.44 19.51,36.88 20.73,36.88 20.73,35.66 20.73,34.44
GVDD  (via drill 0.33)  (5 unrouted)
  Top 0.305: U1.6 55.52,31.85 | 55.52,31.85 55.52,30.43 v55.63,30.33 | U1.7 55.63,31.96 55.52,31.85
  Top 0.406: R47.P$2 v57.15,27.43
  Bottom 0.305: C55.P$1 55.47,30.48 v55.63,30.33
  Bottom 0.406: C55.P$1 C56.P$1 | v55.63,30.33 56.69,30.33 57.15,29.87 v57.15,27.43
IN_SUB_CAP_N
  Top 0.254: 17.14,30.76 17.14,24 17.98,23.16 20.22,23.16 C40.2
  Top 0.305: U2.5 17.23,30.85 17.14,30.76
IN_SUB_CAP_P
  Top 0.254: 16.69,30.76 16.69,24 15.85,23.16 13.61,23.16 C39.2
  Top 0.305: U2.4 16.58,30.86 16.69,30.76
LIN_CAP1_N
  Top 0.254: C58.2 64.59,23.11 64.08,23.62 64.08,24.94 63.19,25.83 59.68,25.83 58.77,26.74 U1.11
LIN_CAP1_P
  Top 0.254: C57.2 63.12,23.11 63.63,23.62 63.63,24.75 63,25.37 59.49,25.37 58.12,26.74 U1.10
MODSEL  (2 unrouted)
MODSEL1  (1 unrouted)
  Top 0.305: U1.1 52.27,31.7 51.66,31.09 R44.P$1
MUTE  (3 unrouted)
  Top 0.305: U1.12 59.42,30.63 R52.P$1 61.28,30.32 62.33,29.26 62.33,28.09 JP11.1
N$1  (1 unrouted)
N$2  (4 unrouted)
N$3
  Top 0.305: ST1.48 94.48,55 C48.P$2
N$4
  pour Top (no thermals): 6.1,77.42 6.1,87.93 9.3,91.14 14.48,91.14 14.48,84.12 11.58,81.23 11.58,77.42
N$5
  Top 0.305: U1.30 53.58,40.91 53.03,41.45 50.29,41.45 49.38,42.37 49.38,48.12 C65.1
N$6  (1 unrouted)
  pour Top (no thermals): 54.1,38.4 54.1,41.15 53.19,42.06 50.6,42.06 49.99,42.67 49.99,49.23 49.53,49.68 37.8,49.68 33.53,53.95 33.53,71.32 39.01,71.32 39.01,58.83 41.61,56.24 49.23,56.24 51.51,53.95 51.66,53.8 51.66,44.35 52.27,43.74 53.64,43.74 54.41,42.98 54.41,38.4
N$7  (1 unrouted)
N$8  (1 unrouted)
N$9  (1 unrouted)
N$10  (1 unrouted)
N$11
  Top 0.305: ST1.9 92.07,48.28 C47.P$1
N$12
  Top 0.305: ST1.24 99.98,45.56 100.13,45.42 100.13,44.06 C44.P$1
N$13  (4 unrouted)
N$14
  Top 0.305: ST1.36 103.16,52.28 C43.P$1
N$15
  Top 0.305: IC1.3 36.91,1.85 C49.2
N$16
  Top 0.305: C50.2 38.27,10.46 IC1.5
N$17  (2 unrouted)
N$18  (2 unrouted)
N$19  (2 unrouted)
  pour Top (no thermals): 25.3,77.42 25.3,87.93 22.1,91.14 16.92,91.14 16.92,84.12 19.81,81.23 19.81,77.42
N$20  (3 unrouted)
N$21  (1 unrouted)
  pour Top (no thermals): 33.53,77.42 33.53,87.93 36.73,91.14 41.91,91.14 41.91,84.12 39.01,81.23 39.01,77.42
N$22  (2 unrouted)
N$23  (1 unrouted)
N$24  (1 unrouted)
N$25
  Top 0.61: R54.1 32.12,85.57 C68.1
N$26
  Top 0.305: U1.26 56.17,45.48 55.63,46.02 55.63,48.04 C72.1
N$27
  Top 0.305: U1.24 57.48,45.44 58.06,46.02 58.06,48.04 C73.1
N$28
  Top 0.305: U1.20 60.08,40.87 60.66,41.45 63.4,41.45 64.31,42.37 64.31,48.12 C74.1
N$29  (1 unrouted)
  pour Top (no thermals): 55.4,38.4 55.4,43.66 53.26,45.8 53.26,55.25 47.24,61.26 47.24,71.32 52.73,71.32 52.73,62.79 55.02,60.5 55.02,45.72 55.63,45.11 55.63,38.4
N$31  (1 unrouted)
  pour Top (no thermals): 57.99,38.4 57.99,45.03 58.67,45.72 58.67,60.5 60.96,62.79 60.96,71.32 66.45,71.32 66.45,61.26 62.94,57.91 60.35,55.32 60.35,45.8 58.22,43.66 58.22,38.4
N$34  (1 unrouted)
  pour Top (no thermals): 59.28,38.4 59.28,42.98 60.05,43.74 61.11,43.74 61.72,44.35 61.72,53.8 64.16,56.24 70.71,56.24 74.68,60.2 74.68,71.32 80.16,71.32 80.16,55.17 74.83,49.83 64.31,49.83 63.7,49.23 63.7,42.67 63.09,42.06 60.5,42.06 59.59,41.15 59.59,38.4
N$35  (1 unrouted)
  pour Top (no thermals): 52.73,77.42 52.73,87.93 49.53,91.14 44.35,91.14 44.35,84.12 47.24,81.23 47.24,77.42
N$36  (1 unrouted)
  pour Top (no thermals): 60.96,77.42 60.96,87.93 64.16,91.14 69.34,91.14 69.34,84.12 66.45,81.23 66.45,77.42
N$37  (1 unrouted)
  pour Top (no thermals): 80.16,77.42 80.16,87.93 76.96,91.14 71.78,91.14 71.78,84.12 74.68,81.23 74.68,77.42
N$38
  Top 0.61: R58.1 54.14,85.57 C78.1
N$39
  Top 0.61: R59.1 59.55,85.57 C79.1
N$40
  Top 0.61: R60.1 81.57,85.57 C80.1
N$56
  Top 0.406: D2.C R16.P$2
OA1_+
  Top 0.305: OA1.3 47.12,4.74 R24.P$2
OA1_-
  Top 0.305: OA1.2 45.85,9.17 45.57,9.45 43.14,9.45 R27.P$1
OA1_OUT
  Top 0.254: OA1.6 47.12,13.7 R26.P$1
  Top 0.305: OA1.6 47.12,11.46 47.09,11.43 | 47.09,11.43 46.63,10.97 R27.P$2 | R28.P$2 50.29,4.72 49.84,5.18 49.84,8.08 49.38,8.53 47.85,8.53 47.09,9.3 47.09,11.43
OA2_-
  Top 0.305: R28.P$1 52.55,4.74 OA2.2 52.55,9.17 52.27,9.45 49.85,9.45 R30.P$1
OA2_OUT
  Top 0.254: OA2.6 53.82,13.7 R29.P$1
  Top 0.305: OA2.6 53.82,11.46 53.34,10.97 49.85,10.97 R30.P$2
OA3_+
  Top 0.305: OA3.3 60.53,4.74 R25.P$2
OA3_-
  Top 0.305: OA3.2 59.26,9.17 58.98,9.45 56.55,9.45 R31.P$1
OA3_OUT
  Top 0.254: OA3.6 60.53,13.7 R33.P$1
  Top 0.305: R31.P$2 59.88,10.96 59.89,10.97 60.05,10.97 60.5,11.43 | OA3.6 60.53,11.46 60.5,11.43 | R32.P$2 63.7,4.72 63.25,5.18 63.25,8.08 62.79,8.53 61.27,8.53 60.5,9.3 60.5,11.43
OA4_-
  Top 0.305: R32.P$1 65.96,4.74 OA4.2 65.96,9.17 65.68,9.45 63.26,9.45 R35.P$1
OA4_OUT
  Top 0.254: OA4.6 67.23,13.7 R34.P$1
  Top 0.305: R35.P$2 66.74,10.96 67.23,11.46 OA4.6
OA_LIN_N
  Top 0.254: C58.1 64.75,18.03 64.08,17.37 64.08,15.76 C16.P$2 R34.P$2
OA_LIN_P
  Top 0.254: C57.1 62.97,18.03 63.63,17.37 63.63,15.76 C16.P$1 63.09,15.23 R33.P$2
OA_RIN_N
  Top 0.254: C54.1 51.41,18.03 50.67,17.3 50.67,15.76 C15.P$2 51.21,15.23 R29.P$2
OA_RIN_P
  Top 0.254: C53.1 49.48,18.03 50.22,17.3 50.22,15.76 C15.P$1 R26.P$2
PVCC  (12 unrouted)
  pour Top (no thermals): 53.04,38.4 47.09,38.4 45.87,37.19 42.52,37.19 42.52,41.15 49.53,41.15 49.83,40.84 52.73,40.84 53.04,40.54
  pour Top (no thermals): 60.66,38.4 67.97,38.4 69.19,37.19 71.93,37.19 71.93,41.15 64.01,41.15 63.7,40.84 60.96,40.84 60.66,40.54
  pour Top (no thermals): 23.01,38.4 30.33,38.4 31.55,37.19 34.29,37.19 34.29,41.15 26.37,41.15 26.06,40.84 23.32,40.84 23.01,40.54
  pour Top (no thermals): 15.39,38.4 9.3,38.4 8.08,37.19 4.72,37.19 4.72,41.15 11.73,41.15 12.04,40.84 15.09,40.84 15.39,40.54
RIN_CAP1_N
  Top 0.254: C54.2 51.18,23.11 50.67,23.62 50.67,24.9 51.15,25.37 53.59,25.37 54.79,26.58 54.79,30.94 54.88,31.02 U1.5
RIN_CAP1_P
  Top 0.254: C53.2 49.71,23.11 50.22,23.62 50.22,25.09 50.96,25.83 53.4,25.83 54.33,26.76 54.33,30.94 54.23,31.04 U1.4
SDZ  (via drill 0.33)  (4 unrouted)
  Top 0.305: U1.2 52.92,30.83 51.82,29.72 v50.9,29.72 R45.P$1
SYNC1
  Top 0.305: U1.16 63.06,31.96 R36.P$2
SYNC2  (2 unrouted)
USB_D_N
  Top 0.254: CN1.D- 93.08,10.57 R4.P$1
USB_D_P
  Top 0.254: CN1.D+ 93.88,10.53 R3.P$1 R5.P$1
USB_SHIELD  (via drill 0.61)
  Bottom 0.508: C13.P$1 v92.51,1.37 | R23.P$1 v93.88,1.37 | C14.P$1 v95.4,1.37
  pour Top (no thermals): 88.54,8.53 88.54,0.76 99.21,0.76 99.21,8.53 97.38,8.53 97.38,3.2 90.53,3.2 90.37,3.2 90.37,8.53
USB_VBUS
  Top 0.508: C6.P$1 87.82,13.12 L1.1
  pour Top (no thermals): 92.51,6.86 90.83,6.86 90.83,8.99 86.72,8.99 86.72,13.87 88.85,13.87 88.85,11.28 91.9,11.28 91.9,10.06 92.51,10.06
V+  (16 unrouted)
V-  (16 unrouted)
VBUS  (1 unrouted)
  Top 0.406: L1.2 86.29,15.88 85.65,15.24 85.65,2.59 84.28,1.22 D2.A
VCCL
  Top 0.305: U$1.27 83.55,27.41 C7.P$1
VCCP
  Top 0.406: U$1.2 87.31,20.15 C3.P$1
VCCR
  Top 0.305: U$1.30 83.55,25.01 C8.P$1
VCOM
  Top 0.406: U$1.32 85.31,22.82 83.67,21.18 83.67,19.53 C4.+
VDD  (4 unrouted)
  Top 0.406: U$1.21 88.91,31.31 C5.P$2 | U$1.9 U$1.10 | U$1.16 94.25,29.01 R2.P$2
VDD_LED
  Top 0.406: D1.C R6.P$1
VOUTL
  Top 0.305: U$1.28 82.82,26.61 C12.P$1 R18.P$2 77.15,27.6 C10.+
VOUTL_CAP
  Top 0.305: C12.P$2 R22.P$2
VOUTL_OUT  (2 unrouted)
  Top 0.406: C10.- 75.54,29.97 74.98,29.41 74.98,4.57 73.15,2.74 62.64,2.74 62.03,3.35 62.03,4.71 R25.P$1
VOUTR
  Top 0.305: U$1.29 82.82,25.81 C11.P$1 R17.P$2 77.15,24.83 C9.+
VOUTR_CAP
  Top 0.305: C11.P$2 R21.P$2
VOUTR_OUT  (2 unrouted)
  Top 0.305: 43.28,3.51 48.62,3.51
  Top 0.406: C9.- 76.81,4.42 73.91,1.52 50.29,1.52 48.62,3.2 48.62,3.51 48.62,4.71 R24.P$1
XTI
  Top 0.254: U$1.12 94.59,25.81 R1.P$1 96.81,25.46 Q1.1 101.61,23.83 C2.P$1
XTO
  Top 0.254: U$1.13 94.59,26.61 R1.P$2 96.51,26.96 Q1.2 101.61,28.91 C1.P$1